# Altium schematic sheet SignalConditioning.SchDoc
size A4; CompanyName: Technische Hochschule Nürnberg Georg Simon Ohm; Address1: Fürther Straße 250; Address2: 90429 Nürnberg; Address3: GERMANY; DocumentNumber: 2; SheetNumber: 2; SheetTotal: 16; CompanyName2: Institut ELSYS
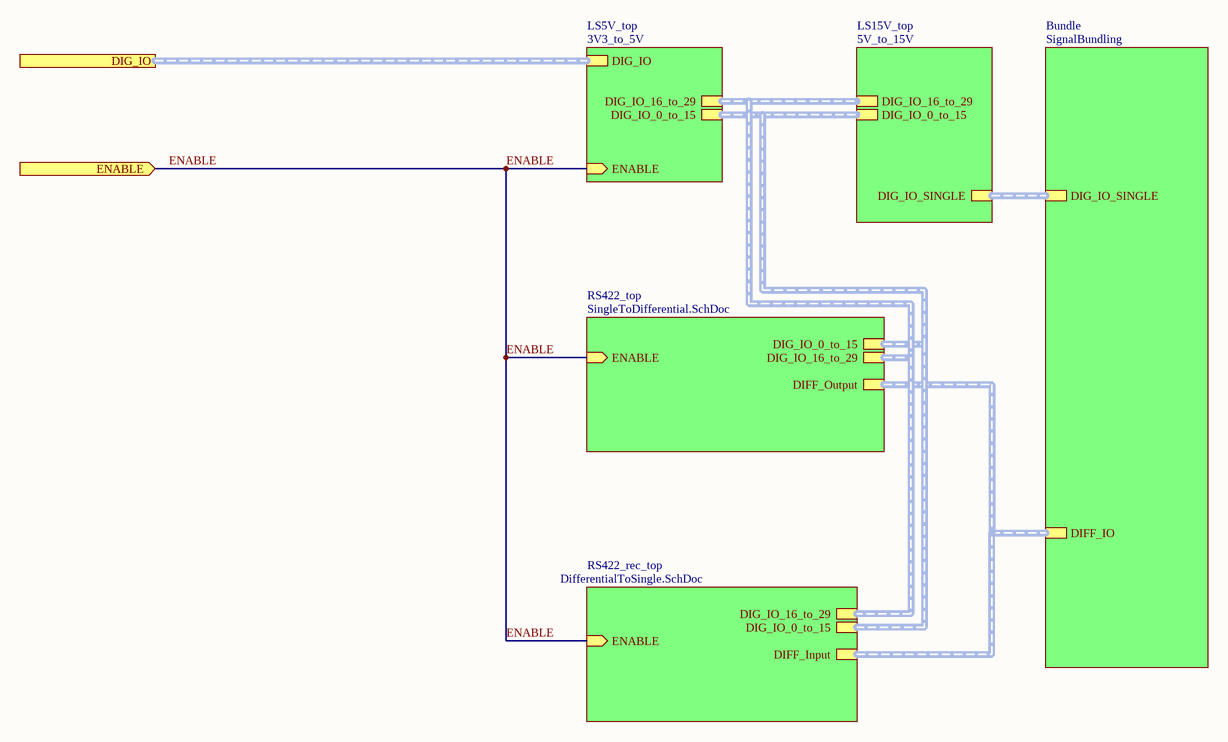
[diagram p0: SignalConditioning.SchDoc]

## Sub-sheets
Bundle = SignalBundling: DIFF_IO (harness DIFF_IO), DIG_IO_SINGLE (harness DIG_IO_SINGLE)
LS5V_top = 3V3_to_5V: DIG_IO (harness DigCon_DIG_IO), DIG_IO_16_to_29 (harness SN74LVCH16T245_B), DIG_IO_0_to_15 (harness SN74LVCH16T245_B), ENABLE (in)
LS15V_top = 5V_to_15V: DIG_IO_16_to_29 (harness SN74LVCH16T245_B), DIG_IO_0_to_15 (harness SN74LVCH16T245_B), DIG_IO_SINGLE (harness DIG_IO_SINGLE)
RS422_rec_top = DifferentialToSingle.SchDoc: ENABLE (in), DIFF_Input (harness DIFF_IO), DIG_IO_16_to_29 (harness SN74LVCH16T245_B), DIG_IO_0_to_15 (harness SN74LVCH16T245_B)
RS422_top = SingleToDifferential.SchDoc: ENABLE (in), DIG_IO_16_to_29 (harness SN74LVCH16T245_B), DIG_IO_0_to_15 (harness SN74LVCH16T245_B), DIFF_Output (harness DIFF_IO)

## Ports
DIG_IO (harness DigCon_DIG_IO), ENABLE (in)

## Nets
ENABLE: port ENABLE, sheet LS5V_top/ENABLE, sheet RS422_top/ENABLE, sheet RS422_rec_top/ENABLE

## Buses and harness runs
harness port DIG_IO = sheet LS5V_top/DIG_IO
harness sheet Bundle/DIFF_IO = sheet RS422_rec_top/DIFF_Input = sheet RS422_top/DIFF_Output
harness sheet Bundle/DIG_IO_SINGLE = sheet LS15V_top/DIG_IO_SINGLE
harness sheet LS5V_top/DIG_IO_0_to_15 = sheet LS15V_top/DIG_IO_0_to_15 = sheet RS422_rec_top/DIG_IO_0_to_15 = sheet RS422_top/DIG_IO_0_to_15
harness sheet LS5V_top/DIG_IO_16_to_29 = sheet LS15V_top/DIG_IO_16_to_29 = sheet RS422_rec_top/DIG_IO_16_to_29 = sheet RS422_top/DIG_IO_16_to_29

## Notes on the sheet
- Title
- Size:
- Date:
- A4
- Revision:
- Time:
- Sheet
- of
- Author:
- Project: